# EAGLE design mega_shield (EAGLE 6.5.0)
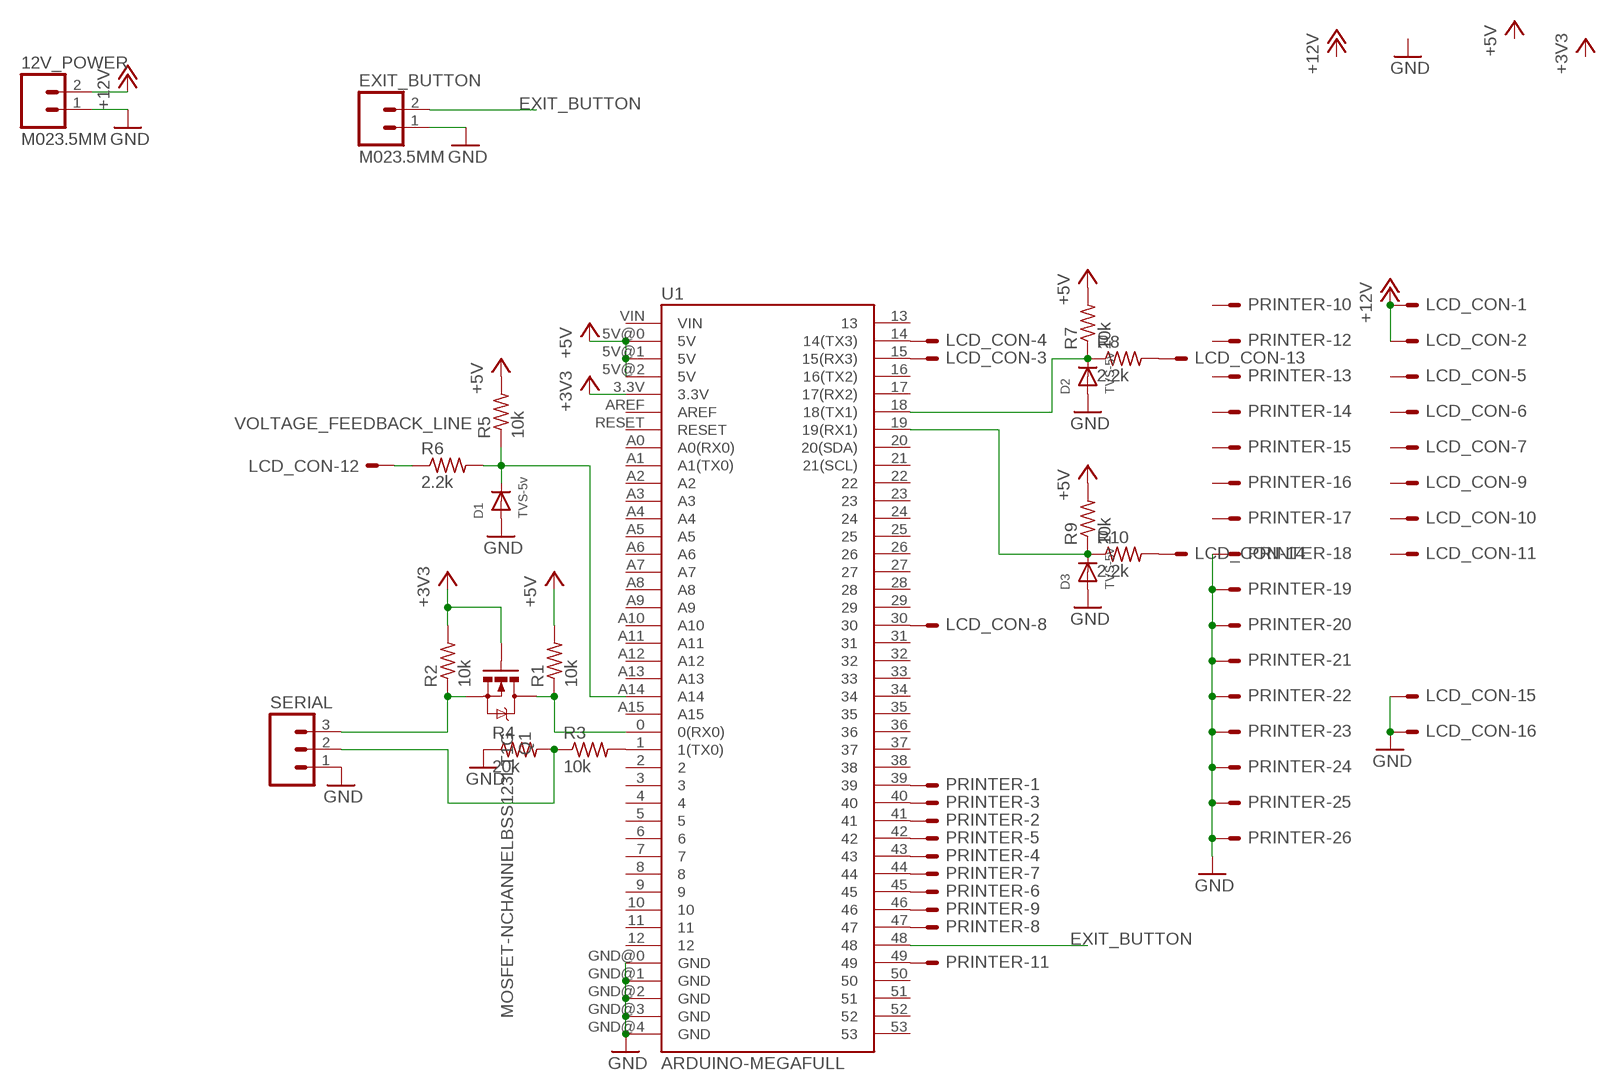
[diagram p0: schematic, sheet 1]

## Parts
12V_POWER  M023.5MM  [SCREWTERMINAL-3.5MM-2]
D1  TVS-5v  DIODESOD-123  [SOD-123]
D2  TVS-5v  DIODESOD-123  [SOD-123]
D3  TVS-5v  DIODESOD-123  [SOD-123]
EXIT_BUTTON  M023.5MM  [SCREWTERMINAL-3.5MM-2]
LCD_CON  ML16E  [ML16]
PRINTER  ML26E  [ML26]
Q1  MOSFET-NCHANNELBSS123LT1G  [SOT23]
R1  10k  R-US_R0603  [R0603]
R2  10k  R-US_R0603  [R0603]
R3  10k  R-US_R0603  [R0603]
R4  20k  R-US_R0603  [R0603]
R5  10k  R-US_R0603  [R0603]
R6  2.2k  R-US_R0603  [R0603]
R7  10k  R-US_R0603  [R0603]
R8  2.2k  R-US_R0603  [R0603]
R9  10k  R-US_R0603  [R0603]
R10  2.2k  R-US_R0603  [R0603]
SERIAL  M03SCREW  [SCREWTERMINAL-3.5MM-3]
U1  ARDUINO-MEGAFULL  [ARDUINO_MEGA]

## Nets
+3V3: Q1.1(G) R2.2 U1.3.3V
+5V: R1.2 R5.2 R7.2 R9.2 U1.5V@0(5V) U1.5V@1(5V) U1.5V@2(5V)
+12V: 12V_POWER.2 LCD_CON.1 LCD_CON.2
EXIT_BUTTON: EXIT_BUTTON.2 U1.48
GND: 12V_POWER.1 D1.A D2.A D3.A EXIT_BUTTON.1 LCD_CON.15 LCD_CON.16 PRINTER.18 PRINTER.19 PRINTER.20 PRINTER.21 PRINTER.22 PRINTER.23 PRINTER.24 PRINTER.25 PRINTER.26 R4.1 SERIAL.1 U1.GND@0(GND) U1.GND@1(GND) U1.GND@2(GND) U1.GND@3(GND) U1.GND@4(GND)
N$1: LCD_CON.3 U1.15(15(RX3))
N$2: LCD_CON.4 U1.14(14(TX3))
N$3: PRINTER.1 U1.39
N$4: PRINTER.11 U1.49
N$5: PRINTER.2 U1.41
N$6: PRINTER.3 U1.40
N$7: PRINTER.4 U1.43
N$8: PRINTER.5 U1.42
N$9: PRINTER.6 U1.45
N$10: PRINTER.7 U1.44
N$11: PRINTER.8 U1.47
N$12: PRINTER.9 U1.46
N$13: LCD_CON.8 U1.30
N$14: R3.2 U1.1(1(TX0))
N$15: R3.1 R4.2 SERIAL.2
N$16: D1.C R5.1 R6.2 U1.A14
N$17: Q1.2(S) R2.1 SERIAL.3
N$18: Q1.3(D) R1.1 U1.0(0(RX0))
N$19: D2.C R7.1 R8.1 U1.18(18(TX1))
N$20: D3.C R9.1 R10.1 U1.19(19(RX1))
N$23: LCD_CON.13 R8.2
N$24: LCD_CON.14 R10.2
VOLTAGE_FEEDBACK_LINE: LCD_CON.12 R6.1
Unconnected: LCD_CON.5 LCD_CON.6 LCD_CON.7 LCD_CON.9 LCD_CON.10 LCD_CON.11 PRINTER.10 PRINTER.12 PRINTER.13 PRINTER.14 PRINTER.15 PRINTER.16 PRINTER.17 U1.2 U1.3 U1.4 U1.5 U1.6 U1.7 U1.8 U1.9 U1.10 U1.11 U1.12 U1.13 U1.16(16(TX2)) U1.17(17(RX2)) U1.20(20(SDA)) U1.21(21(SCL)) U1.22 U1.23 U1.24 U1.25 U1.26 U1.27 U1.28 U1.29 U1.31 U1.32 U1.33 U1.34 U1.35 U1.36 U1.37 U1.38 U1.50 U1.51 U1.52 U1.53 U1.A0(A0(RX0)) U1.A1(A1(TX0)) U1.A2 U1.A3 U1.A4 U1.A5 U1.A6 U1.A7 U1.A8 U1.A9 U1.A10 U1.A11 U1.A12 U1.A13 U1.A15 U1.AREF U1.RESET U1.VIN

## Library data of the parts
12V_POWER EXIT_BUTTON = SparkFun-Connectors:M02: Standard 2-pin 0.1" header. Use with - straight break away headers ( PRT-00116) - right angle break away headers (PRT-00553) - swiss pins (PRT-00743) - machine pins (PRT-00117) - female headers (PRT-00115) Molex polarized connector foot print use with: PRT-08233 with associated crimp pins and housings. 2.54_SCREWTERM for use with PRT-10571. 3.5mm Screw Terminal footprints for PRT-08084 5mm Screw Terminal footprints for use with PRT-08433
D1-D3 = adafruit:DIODE: Diode SMADIODE - SMA Surface Mount Package 20V 1A Schottky Diode Digikey: 641-1014-6-ND DO-1N4148 - Through Hole Small Current Diode SOD-123 20V 1 A (.5mV Vf) Schottky Diode - Digikey: MBRX120TPMSCT-ND SOD-323 10V 570mA (.38mV Vf, 3ns) Schottky Diode - Digikey: ZLLS410CT-ND SOD-523 30V 30mA Schottky Diode (RB751S-40TE61) - Digikey: RB751S-40TE61CT-ND SOT23-R/W - SOT23 Package (R = Solder Paste/Reflow Ovens, W = Hand-Soldering) BAT54Film 40V 300mA - Digikey: 497-7162-1-ND
LCD_CON = con-harting-ml:ML16?E: HARTING; OC_FARNELL: unknown; OC_NEWARK: unknown
PRINTER = con-harting-ml:ML26?E: HARTING; OC_FARNELL: unknown; OC_NEWARK: unknown
Q1 = SparkFun-DiscreteSemi:MOSFET-NCHANNEL: Common NMOSFET Parts MFG P/N Store ID Prod ID FDD8780 TRANS-09984 SI7820DN TRANS-11055 FDS6630A IC-08089 2N7002PW TRANS-11151 FQP30N06L COM-10213 TRANS-10060 BSS123LT1G TRANS-08345 BSS138 TRANS-00830 BS170 2N7000; PROD_ID: TRANS-08345
R1-R10 = resistor:R-US_: RESISTOR, American symbol
SERIAL = SparkFun-Connectors:M03: Header 3 Standard 3-pin 0.1" header. Use with straight break away headers (SKU : PRT-00116), right angle break away headers (PRT-00553), swiss pins (PRT-00743), machine pins (PRT-00117), and female headers (PRT-00115). Molex polarized connector foot print use with SKU : PRT-08232 with associated crimp pins and housings.
U1 = SparkFun-Boards:ARDUINO-MEGA: Arduino Mega board footprint

## Board
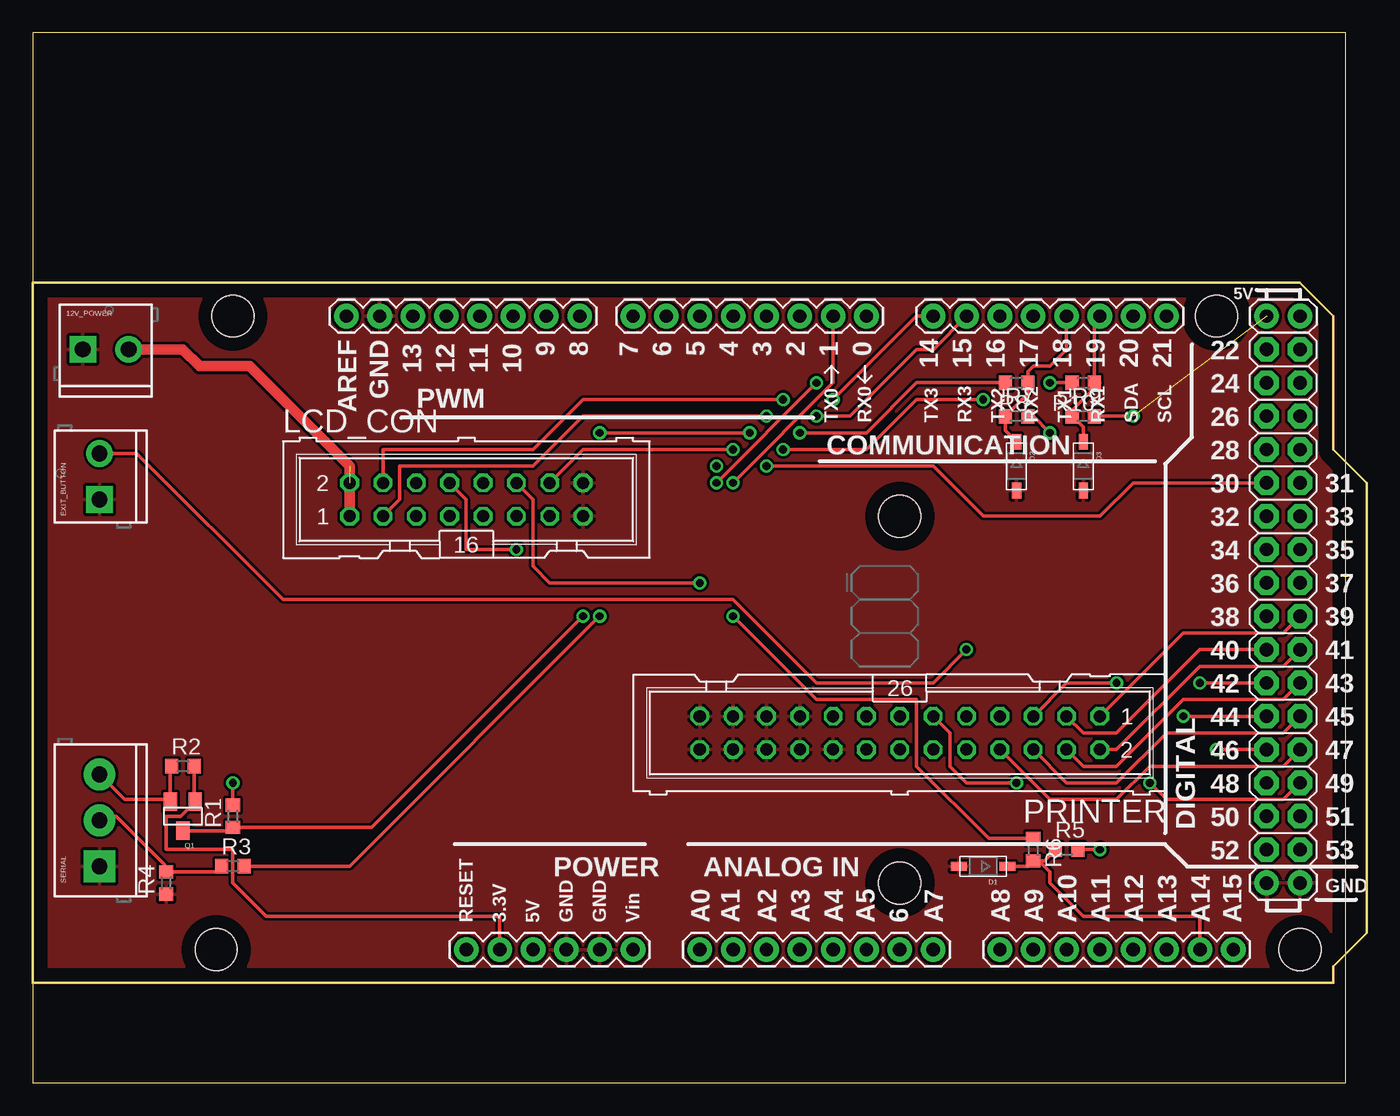
[diagram p1: board, top side]
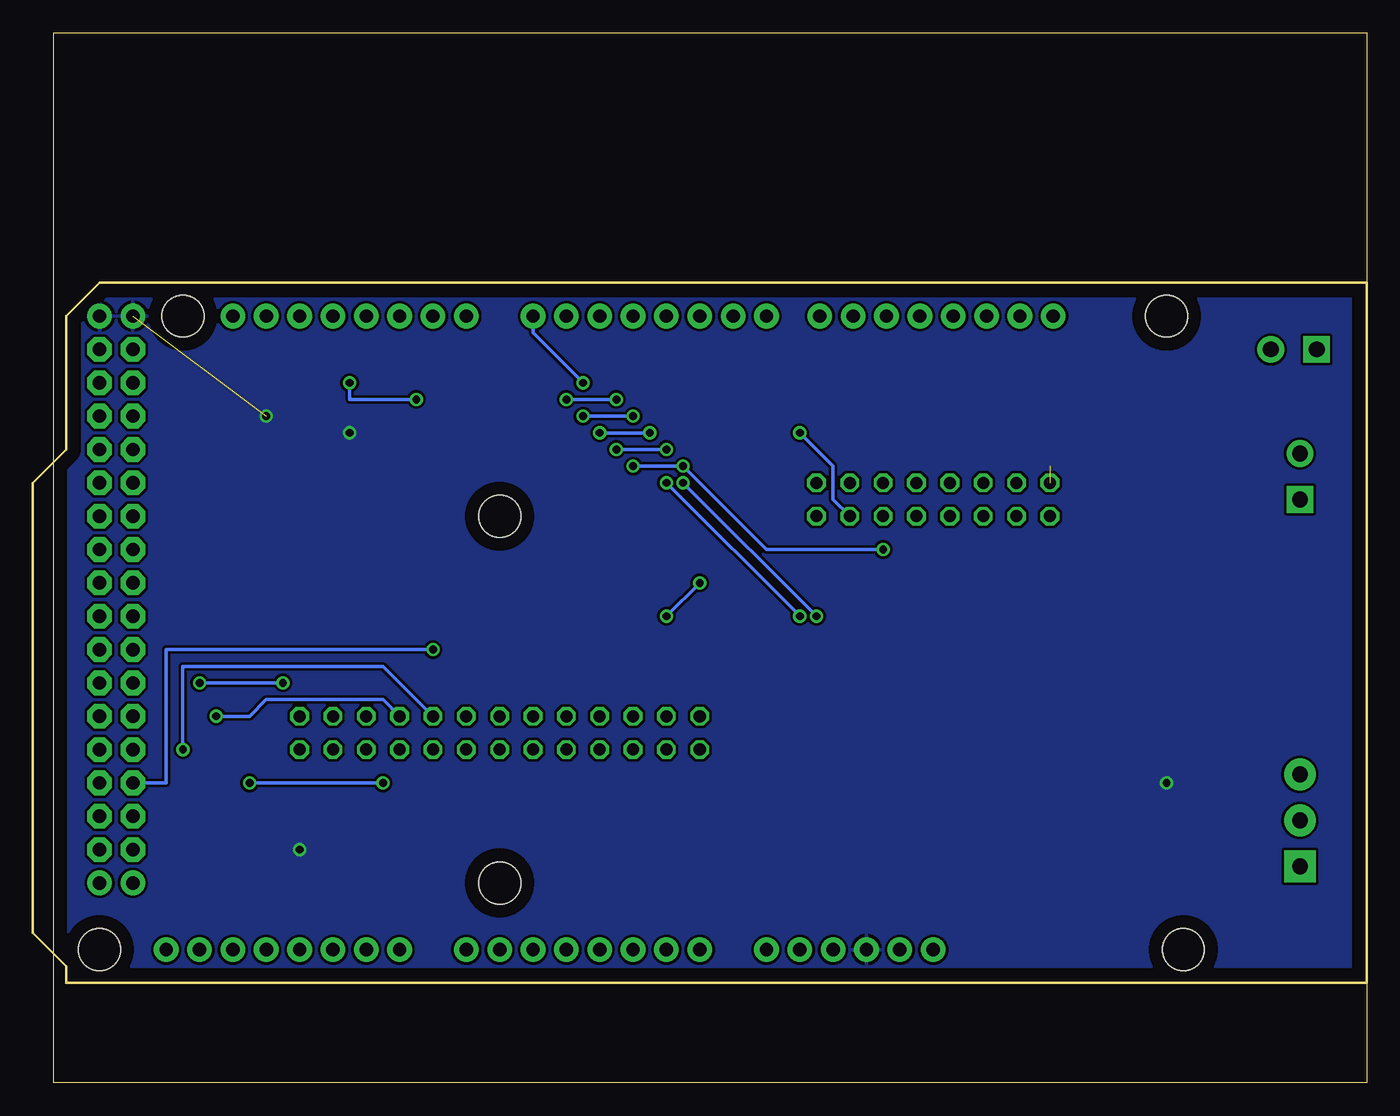
[diagram p2: board, bottom side, seen from below]

Size 100 x 80 mm. Coordinates in mm from the lower left corner, seen from the top.
Outline: 0,0 100,0 100,80 0,80 0,0
Copper layers (1*16): Top 0.035mm / dielectric 1.5mm / Bottom 0.035mm
Design rules "default": minimum track width 10mil, minimum drill 24mil, track to track 8mil, track to pad 8mil, pad to pad 8mil, via to via 8mil, smd to smd 8mil, copper to edge 40mil, drill to drill 8mil, minimum pad ring 10mil, minimum via ring 8mil, stop-mask expansion 4mil, vias tented up to drill 0mil, thermal gap 10mil

### Footprints (pad centres in the part's own frame; a part is rotated, then mirrored left to right if it is on the bottom)
SCREWTERMINAL-3.5MM-2 = drill 1.2 pad 2.032 square: 1 0,0 | drill 1.2 pad 2.032: 2 3.5,0
SOD-123 = smd 1.2 x 0.7: A 1.85,0; C -1.85,0
ML16 = drill 0.914 octagon: 1 -8.89,-1.27; 2 -8.89,1.27; 3 -6.35,-1.27; 4 -6.35,1.27; 5 -3.81,-1.27; 6 -3.81,1.27; 7 -1.27,-1.27; 8 -1.27,1.27; 9 1.27,-1.27; 10 1.27,1.27; 11 3.81,-1.27; 12 3.81,1.27; 13 6.35,-1.27; 14 6.35,1.27; 15 8.89,-1.27; 16 8.89,1.27
ML26 = drill 0.914 octagon: 1 -15.24,-1.27; 2 -15.24,1.27; 3 -12.7,-1.27; 4 -12.7,1.27; 5 -10.16,-1.27; 6 -10.16,1.27; 7 -7.62,-1.27; 8 -7.62,1.27; 9 -5.08,-1.27; 10 -5.08,1.27; 11 -2.54,-1.27; 12 -2.54,1.27; 13 0,-1.27; 14 0,1.27; 15 2.54,-1.27; 16 2.54,1.27; 17 5.08,-1.27; 18 5.08,1.27; 19 7.62,-1.27; 20 7.62,1.27; 21 10.16,-1.27; 22 10.16,1.27; 23 12.7,-1.27; 24 12.7,1.27; 25 15.24,-1.27; 26 15.24,1.27
SOT23 = smd 1 x 1.4: 1 -0.95,-1.1; 2 0.95,-1.1; 3 0,1.1
R0603 = smd 1 x 1.1: 1 -0.85,0; 2 0.85,0
SCREWTERMINAL-3.5MM-3 = drill 1.2 pad 2.413 square: 1 0,0 | drill 1.2 pad 2.413: 2 3.5,0; 3 7,0
ARDUINO_MEGA = drill 1.016 pad 1.88: 0 63.5,50.8; 1 60.96,50.8; 2 58.42,50.8; 3 55.88,50.8; 3.3V 35.56,2.54; 4 53.34,50.8; 5 50.8,50.8; 5V@0 38.1,2.54; 5V@1 93.98,50.8; 5V@2 96.52,50.8; 6 48.26,50.8; 7 45.72,50.8; 8 41.656,50.8; 9 39.116,50.8; 10 36.576,50.8; 11 34.036,50.8; 12 31.496,50.8; 13 28.956,50.8; 14 68.58,50.8; 15 71.12,50.8; 16 73.66,50.8; 17 76.2,50.8; 18 78.74,50.8; 19 81.28,50.8; 20 83.82,50.8; 21 86.36,50.8; A0 50.8,2.54; A1 53.34,2.54; A2 55.88,2.54; A3 58.42,2.54; A4 60.96,2.54; A5 63.5,2.54; A6 66.04,2.54; A7 68.58,2.54; A8 73.66,2.54; A9 76.2,2.54; A10 78.74,2.54; A11 81.28,2.54; A12 83.82,2.54; A13 86.36,2.54; A14 88.9,2.54; A15 91.44,2.54; AREF 23.876,50.8; GND@0 40.64,2.54; GND@1 43.18,2.54; GND@2 93.98,7.62; GND@3 96.52,7.62; GND@4 26.416,50.8; RESET 33.02,2.54; VIN 45.72,2.54 | drill 1.016 pad 1.88 octagon: 22 93.98,48.26; 23 96.52,48.26; 24 93.98,45.72; 25 96.52,45.72; 26 93.98,43.18; 27 96.52,43.18; 28 93.98,40.64; 29 96.52,40.64; 30 93.98,38.1; 31 96.52,38.1; 32 93.98,35.56; 33 96.52,35.56; 34 93.98,33.02; 35 96.52,33.02; 36 93.98,30.48; 37 96.52,30.48; 38 93.98,27.94; 39 96.52,27.94; 40 93.98,25.4; 41 96.52,25.4; 42 93.98,22.86; 43 96.52,22.86; 44 93.98,20.32; 45 96.52,20.32; 46 93.98,17.78; 47 96.52,17.78; 48 93.98,15.24; 49 96.52,15.24; 50 93.98,12.7; 51 96.52,12.7; 52 93.98,10.16; 53 96.52,10.16 | hole 3.2: 15.24,50.8; 13.97,2.54; 66.04,35.56; 66.04,7.62; 90.17,50.8; 96.52,2.54

### Placement (x,y rotation side)
12V_POWER  3.81,55.88 0 top
D1  72.39,16.51 180 top
D2  74.93,46.99 270 top
D3  80.01,46.99 270 top
EXIT_BUTTON  5.08,44.45 90 top
LCD_CON  33.02,44.45 0 top
PRINTER  66.04,26.67 180 top
Q1  11.43,20.32 180 top
R1  15.24,20.32 90 top
R2  11.43,24.13 0 top
R3  15.24,16.51 0 top
R4  10.16,15.24 90 top
R5  78.74,17.78 0 top
R6  76.2,17.78 270 top
R7  74.93,50.8 0 top
R8  74.93,53.34 180 top
R9  80.01,50.8 0 top
R10  80.01,53.34 180 top
SERIAL  5.08,16.51 90 top
U1  0,7.62 0 top

### Tracks (layer width: path | path; a pad name or v marks a point on that pad's centre or on a via)
+3V3
  Top 0.254: R2.2 12.28,21.52 Q1.1 11.28,20.32 10.16,20.32 10.16,17.78 15.24,17.78 15.24,15.24 17.78,12.7 35.56,12.7 U1.3.3V
+5V  (via drill 0.6)  (1 unrouted)
  Top 0.254: R5.2 v81.28,17.78 | R1.2 v15.24,22.86 | R9.2 v83.82,50.8 | R7.2 76.2,50.8 v77.47,49.53
  pour Bottom: 0,80.01 100.33,80.01 100.33,0 0,0
+12V  (1 unrouted)
  Top 0.813: 12V_POWER.2 11.43,55.88 12.7,54.61 16.51,54.61 24.13,46.99 LCD_CON.1
EXIT_BUTTON  (via drill 0.6)
  Top 0.254: v71.12,33.02 68.58,30.48 59.69,30.48 53.34,36.83 19.05,36.83 7.93,47.95 EXIT_BUTTON.2
  Bottom 0.254: U1.48 91.44,22.86 91.44,33.02 v71.12,33.02
GND
  pour Top: 0,80.01 100.33,80.01 100.33,0 0,0
N$1  (via drill 0.6)
  Top 0.254: LCD_CON.3 27.94,44.45 27.94,46.99 38.1,46.99 41.91,50.8 v55.88,50.8 | U1.15 68.58,55.88 67.31,55.88 62.23,50.8 v59.69,50.8
  Bottom 0.254: v59.69,50.8 v55.88,50.8
N$2  (via drill 0.6)
  Top 0.254: LCD_CON.4 26.67,48.26 38.1,48.26 41.91,52.07 v57.15,52.07 | U1.14 67.31,58.42 v60.96,52.07
  Bottom 0.254: v60.96,52.07 v57.15,52.07
N$3
  Top 0.254: U1.39 95.25,34.29 87.63,34.29 PRINTER.1
N$4  (via drill 0.6)
  Top 0.254: U1.49 95.25,21.59 86.36,21.59 v85.09,22.86 | v74.93,22.86 71.12,22.86 69.85,24.13 69.85,26.67 PRINTER.11
  Bottom 0.254: v85.09,22.86 v74.93,22.86
N$5
  Top 0.254: U1.41 95.25,31.75 88.9,31.75 82.55,25.4 PRINTER.2
N$6
  Top 0.254: U1.40 88.9,33.02 82.55,26.67 80.01,26.67 PRINTER.3
N$7
  Top 0.254: U1.43 95.25,29.21 87.63,29.21 82.55,24.13 80.01,24.13 PRINTER.4
N$8  (via drill 0.6)
  Top 0.254: U1.42 v88.9,30.48 | v82.55,30.48 78.74,30.48 PRINTER.5
  Bottom 0.254: v88.9,30.48 v82.55,30.48
N$9
  Top 0.254: U1.45 95.25,26.67 86.36,26.67 82.55,22.86 78.74,22.86 PRINTER.6
N$10  (via drill 0.6)
  Top 0.254: U1.44 v87.63,27.94
  Bottom 0.254: v87.63,27.94 85.09,27.94 83.82,29.21 74.93,29.21 PRINTER.7
N$11
  Top 0.254: U1.47 95.25,24.13 85.09,24.13 82.55,21.59 77.47,21.59 PRINTER.8
N$12  (via drill 0.6)
  Top 0.254: U1.46 v90.17,25.4
  Bottom 0.254: v90.17,25.4 90.17,31.75 74.93,31.75 PRINTER.9
N$13  (via drill 0.6)
  Top 0.254: U1.30 83.82,45.72 81.28,43.18 72.39,43.18 68.58,46.99 v55.88,46.99 | LCD_CON.8 33.02,44.45 33.02,40.64 v36.83,40.64
  Bottom 0.254: v55.88,46.99 v52.07,46.99 45.72,40.64 v36.83,40.64
N$14  (via drill 0.6)
  Top 0.254: R3.2 24.13,16.51 v43.18,35.56 | v53.34,45.72 60.96,53.34 U1.1
  Bottom 0.254: v43.18,35.56 v53.34,45.72
N$15
  Top 0.254: R3.1 13.97,16.09 R4.2 10.05,16.2 10.05,16.62 6.35,20.32 5.39,20.32 SERIAL.2
N$16
  Top 0.254: U1.A14 88.9,12.7 80.01,12.7 77.47,15.24 77.47,16.09 76.63,16.93 | D1.C 75.78,16.51 R6.2 76.62,16.93 76.63,16.93 | 76.63,16.93 77.04,16.93 R5.1
N$17
  Top 0.254: R2.1 10.48,24.03 Q1.2 10.31,21.59 7,21.59 SERIAL.3
N$18  (via drill 0.6)
  Top 0.254: Q1.3 14.99,19.22 R1.1 25.82,19.47 v41.91,35.56 | v52.07,45.72 v59.69,53.34
  Bottom 0.254: v41.91,35.56 v52.07,45.72 | v59.69,53.34 63.5,57.15 U1.0
N$19
  Top 0.254: U1.18 78.74,55.88 77.47,54.61 76.2,54.61 75.78,54.19 R8.1 75.78,52.5 R7.1 74.08,49.69 D2.C
N$20
  Top 0.254: D3.C 80.01,49.95 R9.1 79.16,51.22 81.28,53.34 R10.1 80.86,58 U1.19
N$23  (via drill 0.6)
  Top 0.254: R8.2 67.31,53.34 63.5,49.53 v58.42,49.53 | v54.61,49.53 v43.18,49.53
  Bottom 0.254: v58.42,49.53 v54.61,49.53 | v43.18,49.53 40.64,46.99 40.64,44.45 LCD_CON.13
N$24  (via drill 0.6)
  Top 0.254: R10.2 v77.47,53.34 | v72.39,52.07 67.31,52.07 63.5,48.26 v57.15,48.26 | v53.34,48.26 41.91,48.26 LCD_CON.14
  Bottom 0.254: v77.47,53.34 77.47,52.07 v72.39,52.07 | v57.15,48.26 v53.34,48.26
VOLTAGE_FEEDBACK_LINE  (via drill 0.6)
  Top 0.254: R6.1 72.81,18.63 67.31,24.13 67.31,29.21 59.69,29.21 v53.34,35.56 | v50.8,38.1 39.37,38.1 38.1,39.37 38.1,44.45 LCD_CON.12
  Bottom 0.254: v53.34,35.56 v50.8,38.1